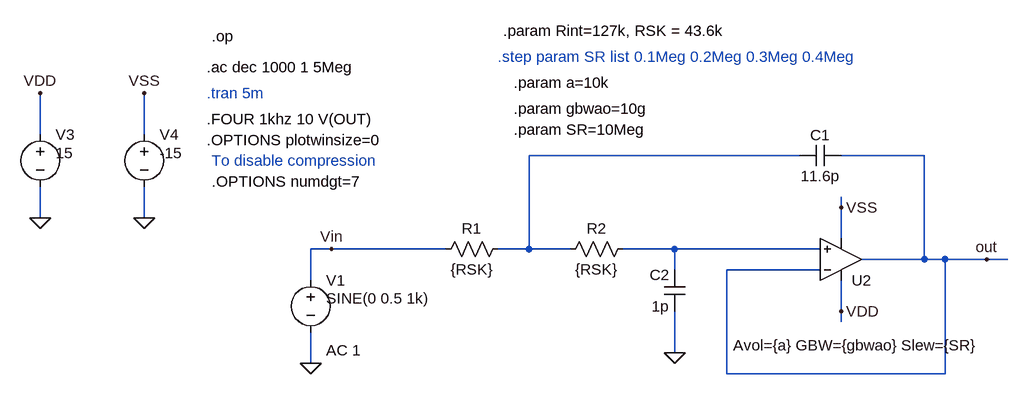
[diagram p0: schematic FTJ_SallenKey.asc]
FTJ_SallenKey.asc, the LTspice schematic file:
Version 4
SHEET 1 2932 1708
WIRE 1088 -16 1088 -80
WIRE 1248 -16 1248 -80
WIRE 2256 16 1840 16
WIRE 2448 16 2320 16
WIRE 2320 96 2320 80
WIRE 1088 112 1088 64
WIRE 1248 112 1248 64
WIRE 2320 144 2320 96
WIRE 1536 160 1504 160
WIRE 1712 160 1536 160
WIRE 1840 160 1840 16
WIRE 1840 160 1792 160
WIRE 1904 160 1840 160
WIRE 2064 160 1984 160
WIRE 2288 160 2064 160
WIRE 2448 176 2448 16
WIRE 2448 176 2352 176
WIRE 2480 176 2448 176
WIRE 2544 176 2480 176
WIRE 2576 176 2544 176
WIRE 2064 192 2064 160
WIRE 2288 192 2144 192
WIRE 1504 208 1504 160
WIRE 2320 256 2320 208
WIRE 2320 272 2320 256
WIRE 2064 320 2064 256
WIRE 1504 336 1504 288
WIRE 2144 352 2144 192
WIRE 2480 352 2480 176
WIRE 2480 352 2144 352
FLAG 2544 176 out
FLAG 1088 112 0
FLAG 1248 112 0
FLAG 1088 -80 VDD
FLAG 1248 -80 VSS
FLAG 2320 96 VSS
FLAG 2320 256 VDD
FLAG 1504 336 0
FLAG 1536 160 Vin
FLAG 2064 320 0
DATAFLAG 1616 160 ""
DATAFLAG 1872 160 ""
DATAFLAG 2144 160 ""
DATAFLAG 2224 192 ""
DATAFLAG 2416 176 ""
SYMBOL cap 2320 0 R90
WINDOW 0 0 32 VBottom 2
WINDOW 3 32 32 VTop 2
SYMATTR InstName C1
SYMATTR Value 11.6p
SYMBOL voltage 1088 -32 R0
WINDOW 123 24 124 Left 2
WINDOW 39 0 0 Left 2
WINDOW 3 24 44 Left 2
SYMATTR Value 15
SYMATTR InstName V3
SYMBOL voltage 1248 -32 R0
WINDOW 123 24 124 Left 2
WINDOW 39 0 0 Left 2
WINDOW 3 24 44 Left 2
SYMATTR Value -15
SYMATTR InstName V4
SYMBOL res 1808 144 R90
WINDOW 0 0 56 VBottom 2
WINDOW 3 32 56 VTop 2
SYMATTR InstName R1
SYMATTR Value {RSK}
SYMBOL res 2000 144 R90
WINDOW 0 0 56 VBottom 2
WINDOW 3 32 56 VTop 2
SYMATTR InstName R2
SYMATTR Value {RSK}
SYMBOL cap 2080 256 R180
WINDOW 0 24 56 Left 2
WINDOW 3 24 8 Left 2
SYMATTR InstName C2
SYMATTR Value 1p
SYMBOL Opamps\\UniversalOpamp2 2320 176 M180
WINDOW 123 -166 -132 Left 2
SYMATTR Value2 Avol={a} GBW={gbwao} Slew={SR}
SYMATTR InstName U2
SYMBOL voltage 1504 192 R0
WINDOW 123 24 124 Left 2
WINDOW 39 0 0 Left 2
WINDOW 3 24 44 Left 2
SYMATTR Value2 AC 1
SYMATTR Value SINE(0 0.5 1k)
SYMATTR InstName V1
TEXT 1344 -120 Left 2 !.ac dec 1000 1 5Meg
TEXT 1352 -168 Left 2 !.op
TEXT 1800 -176 Left 2 !.param Rint=127k, RSK = 43.6k
TEXT 1344 -80 Left 2 ;.tran 5m
TEXT 1816 -96 Left 2 !.param a=10k
TEXT 1816 -56 Left 2 !.param gbwao=10g
TEXT 1816 -24 Left 2 !.param SR=10Meg
TEXT 1344 -40 Left 2 !.FOUR 1khz 10 V(OUT)
TEXT 1344 -8 Left 2 !.OPTIONS plotwinsize=0
TEXT 1352 24 Left 2 ;To disable compression
TEXT 1352 56 Left 2 !.OPTIONS numdgt=7
TEXT 1792 -136 Left 2 ;.step param SR list 0.1Meg 0.2Meg 0.3Meg 0.4Meg

The netlist it stands for:
* FTJ_SallenKey.asc
C1 out N001 11.6p
V3 VDD 0 15
V4 VSS 0 -15
R1 N001 Vin {RSK}
R2 N002 N001 {RSK}
C2 0 N002 1p
XU2 N002 out VDD VSS out level.2 Avol={a} GBW={gbwao} Slew={SR} ilimit=25m rail=0 Vos=0 phimargin=45 en=0 enk=0 in=0 ink=0 Rin=500Meg  ; pins IN+ IN- V+ V- OUT
V1 Vin 0 SINE(0 0.5 1k) AC 1
.ac dec 1000 1 5Meg
.op
.param Rint=127k, RSK = 43.6k
* .tran 5m
.param a=10k
.param gbwao=10g
.param SR=10Meg
.FOUR 1khz 10 V(OUT)
.OPTIONS plotwinsize=0
* To disable compression
.OPTIONS numdgt=7
* .step param SR list 0.1Meg 0.2Meg 0.3Meg 0.4Meg
.lib UniversalOpamps2.sub
.backanno
.end